# Altium project ETZ.PrjPcb
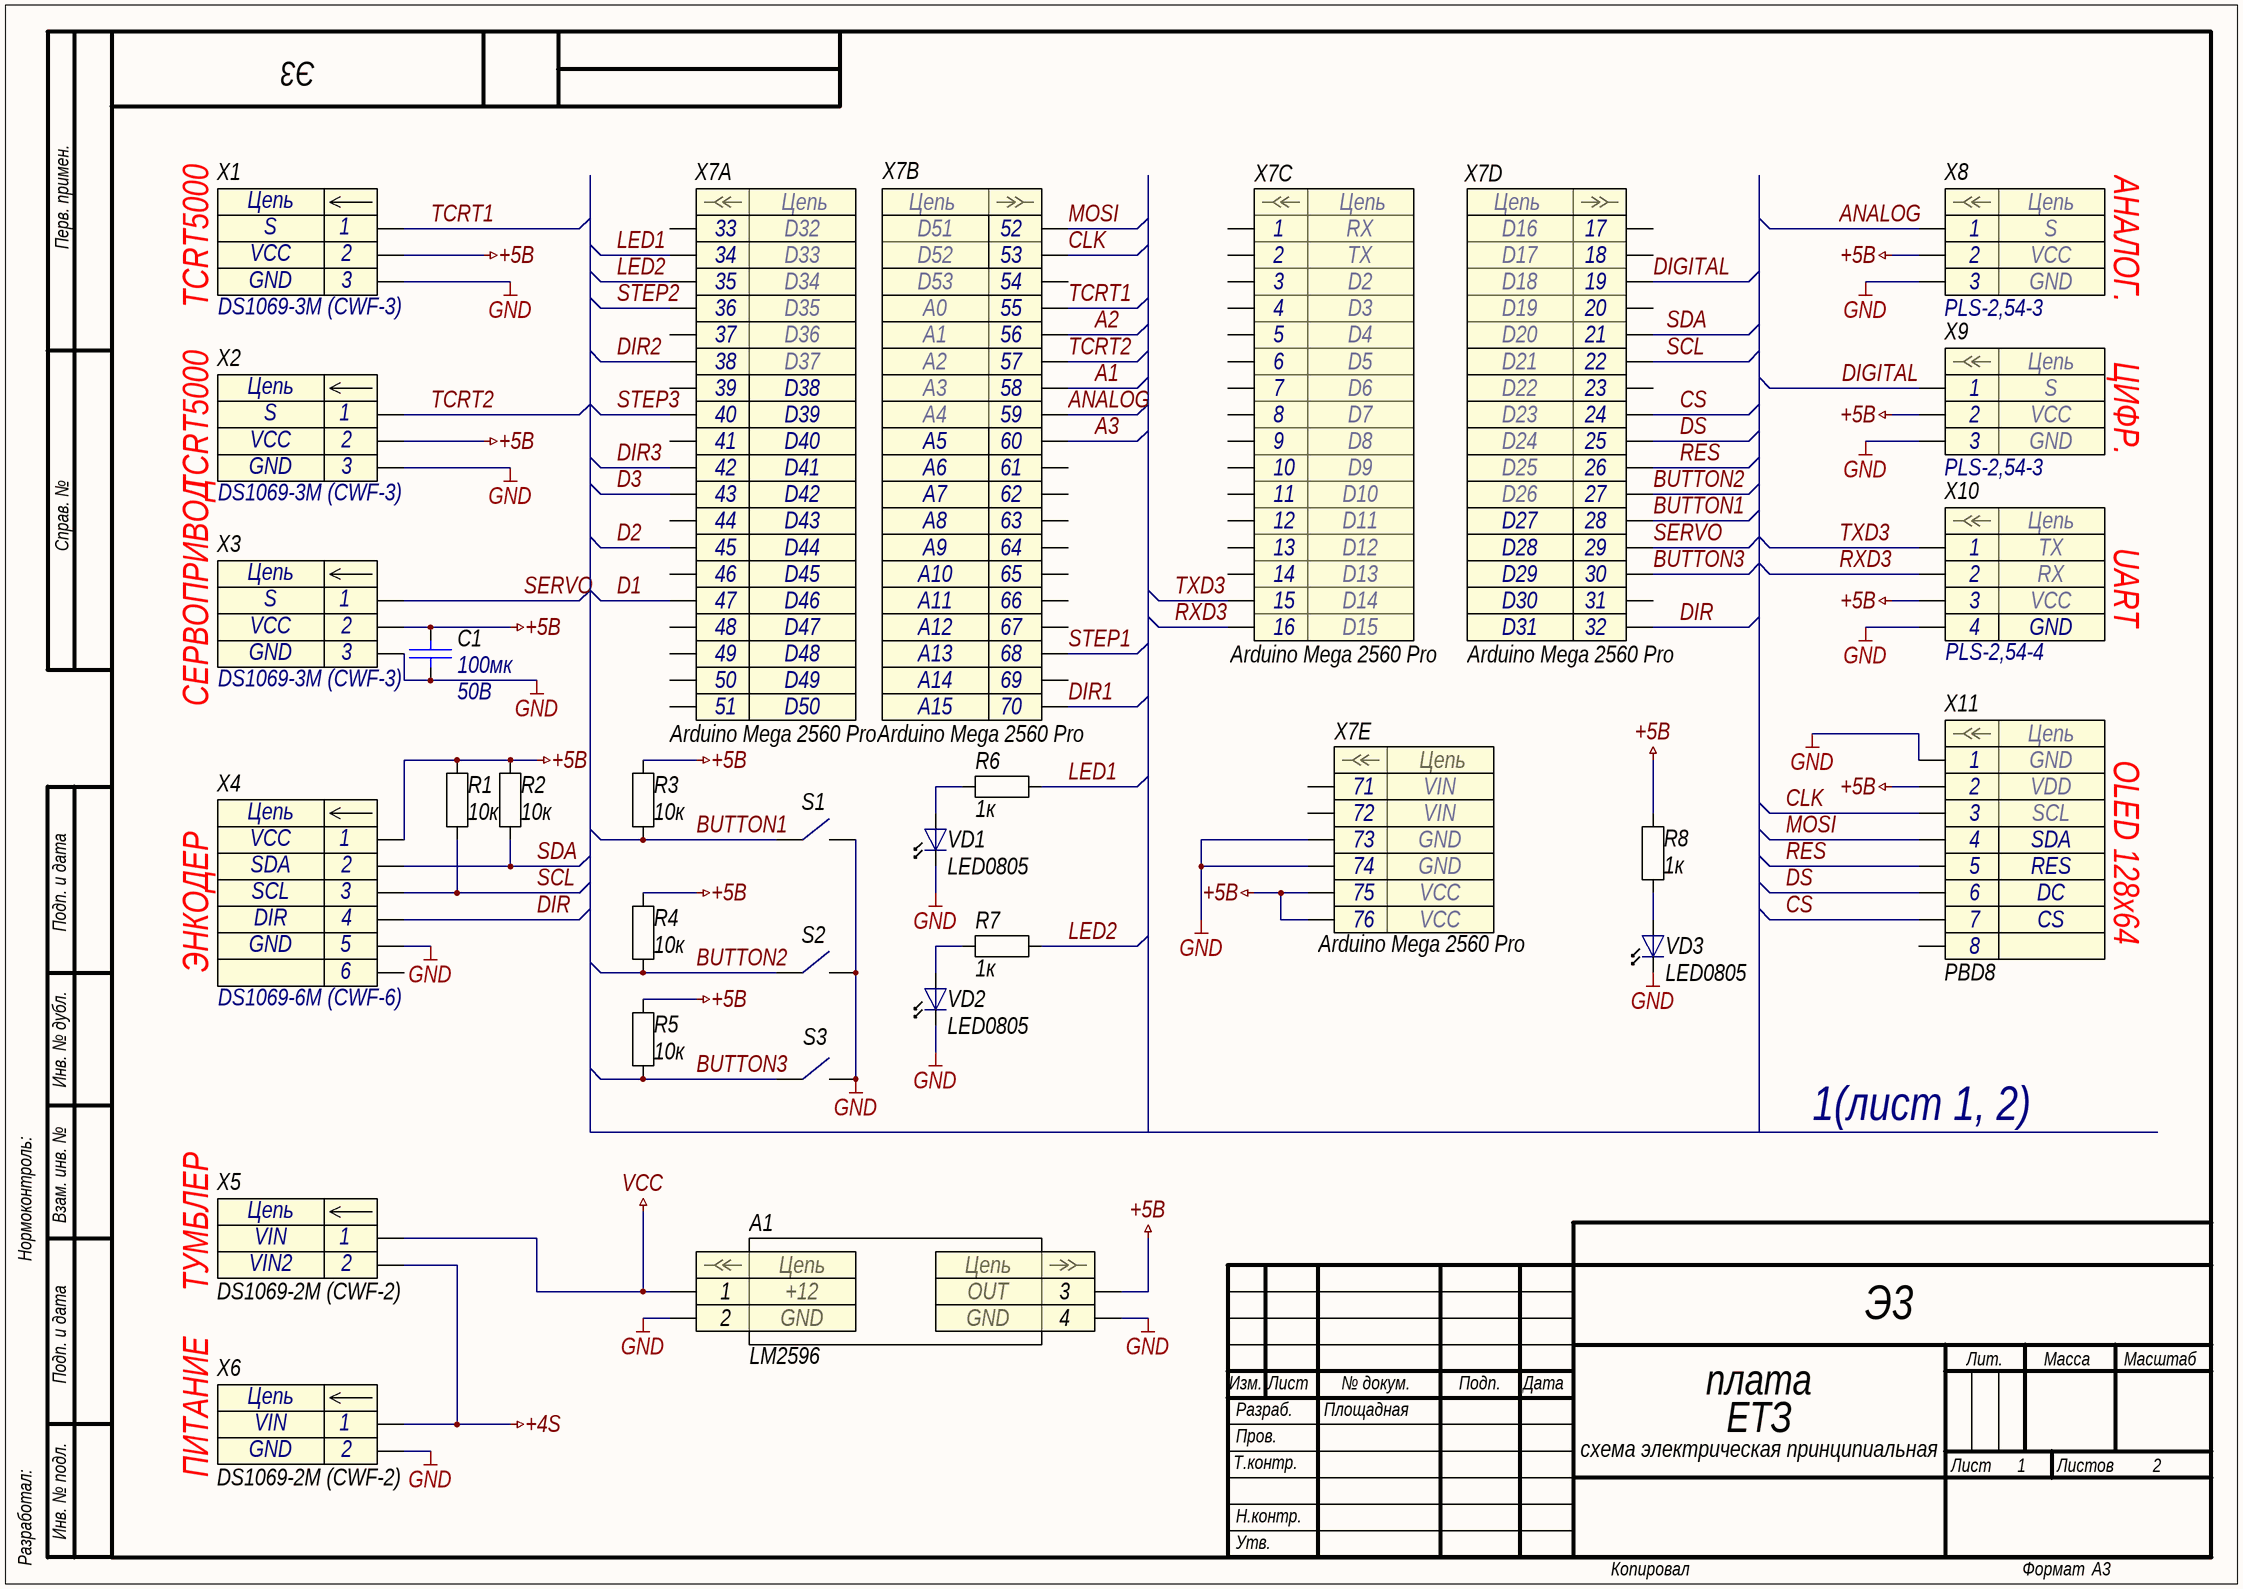
[diagram p0: Э3.SchDoc]
2 sheets, 37 parts. Net scope: global (net labels, ports and power ports of the same name join across sheets).
Board file: ETZZ.PcbDoc
Sheets:
  Э3.SchDoc
  Э3_2.SchDoc

## Sheet Э3.SchDoc: =title_line_1 + title_line_2
size 420 x 297 mm; DrawnBy: Площадная; DocumentNumber: Э3; SheetNumber: 1; SheetTotal: 2; title_line_1: плата; title_line_2: ЕТЗ; document_type: схема электрическая принципиальная

### Parts
A1  LM2596  [LM2596]
C1  Voltage: 50В  [C1210]  (hidden comment: 100мк)
R1  10к  [Resistor0805]
R2  10к  [Resistor0805]
R3  10к  [Resistor0805]
R4  10к  [Resistor0805]
R5  10к  [Resistor0805]
R6  1к  [Resistor0805]
R7  1к  [Resistor0805]
R8  1к  [Resistor0805]
S1  BUTTON12  [THT12]  (value not drawn)
S2  BUTTON12  [THT12]  (value not drawn)
S3  BUTTON12  [THT12]  (value not drawn)
VD1  LED0805  [LED0805]
VD2  LED0805  [LED0805]
VD3  LED0805  [LED0805]
X1  DS1069-3M (CWF-3)  [CWF-3]
X2  DS1069-3M (CWF-3)  [CWF-3]
X3  DS1069-3M (CWF-3)  [CWF-3]
X4  DS1069-6M (CWF-6)  [CWF-6]
X5  DS1069-2M (CWF-2)  [CWF-2]
X6  DS1069-2M (CWF-2)  [CWF-2]
X7  Arduino Mega 2560 Pro  [PBD38]  (parts A,B,C,D,E of 5)
X8  PLS-2,54-3  [PLS-2.54-3]
X9  PLS-2,54-3  [PLS-2.54-3]
X10  PLS-2,54-4  [PLS-2.54-4]
X11  PBD8  [PBD8]

### Nets
+4S: X5.2 X6.1
+5В: A1.3 C1.2 R1.1 R2.1 R3.2 R4.2 R5.2 R8.1 X1.2 X2.2 X3.2 X4.1 X7.75 X7.76 X8.2 X9.2 X10.3 X11.2
GND: A1.2 A1.4 C1.1 S1.1 S2.1 S3.1 VD1.1 VD2.1 VD3.1 X1.3 X2.3 X3.3 X4.5 X6.2 X7.73 X7.74 X8.3 X9.3 X10.4 X11.1
VCC: A1.1 X5.1
A1: X7.58
A2: X7.56
A3: X7.60
ANALOG: X7.59 X8.1
BUTTON1: R3.1 S1.2 X7.28
BUTTON2: R4.1 S2.2 X7.27
BUTTON3: R5.1 S3.2 X7.30
CLK: X7.53 X11.3
CS: X7.24 X11.7
D1: X7.47
D2: X7.45
D3: X7.43
DIGITAL: X7.19 X9.1
DIR: X4.4 X7.32
DIR1: X7.70
DIR2: X7.38
DIR3: X7.42
DS: X7.25 X11.6
LED1: R6.1 X7.34
LED2: R7.1 X7.35
MOSI: X7.52 X11.4
RES: X7.26 X11.5
RXD3: X7.16 X10.2
SCL: R1.2 X4.3 X7.22
SDA: R2.2 X4.2 X7.21
SERVO: X3.1 X7.29
STEP1: X7.68
STEP2: X7.36
STEP3: X7.40
TCRT1: X1.1 X7.55
TCRT2: X2.1 X7.57
TXD3: X7.15 X10.1
NetR6_2: R6.2 VD1.2
NetR7_2: R7.2 VD2.2
NetR8_2: R8.2 VD3.2

Not connected (* = marked no-connect by the designer): X4 6; X7 1 2 3 4 5 6 7 8 9 10 11 12 13 14 17 18 20 23 31 33 37 39 41 44 46 48 49 50 51 54 61 62 63 64 65 66 67 69 71 72; X11 8

### Notes on the sheet
- АНАЛОГ.
- TCRT5000
- ЦИФР.
- UART
- СЕРВОПРИВОД
- OLED 128x64
- ЭНКОДЕР
- 1(лист 1, 2)
- ТУМБЛЕР
- ПИТАНИЕ
- Перв. примен.
- Справ. №
- Подп. и дата
- Инв. № дубл.
- Нормоконтроль:
- Взам. инв. №
- Изм.
- Лист
- № докум.
- Подп.
- Дата
- Лит.
- Масса
- Масштаб
- Т.контр.
- Пров.
- Разраб.
- Листов
- Разработал:
- Инв. № подл.
- Н.контр.
- Утв.
- Копировал
- Формат
- А3
- (in symbol Arduino Mega 2560 Pro, part A) Цепь; D32; D33; D34; D35; D36; D37; D38; D39; D40; D41; D42; D43; D44; D45; D46; D47; D48; D49; D50
- (in symbol Arduino Mega 2560 Pro, part B) Цепь; D51; D52; D53; A0; A1; A2; A3; A4; A5; A6; A7; A8; A9; A10; A11; A12; A13; A14; A15
- (in symbol Arduino Mega 2560 Pro, part C) Цепь; RX; TX; D2; D3; D4; D5; D6; D7; D8; D9; D10; D11; D12; D13; D14; D15
- (in symbol Arduino Mega 2560 Pro, part D) Цепь; D16; D17; D18; D19; D20; D21; D22; D23; D24; D25; D26; D27; D28; D29; D30; D31
- (in symbol Arduino Mega 2560 Pro, part E) Цепь; VIN; GND; VCC
- (in symbol CWF-2) Цепь
- (in symbol CWF-3) Цепь
- (in symbol CWF-6) Цепь
- (in symbol LM2596) Цепь
- (in symbol PBD8) Цепь
- (in symbol PLS-2.54-3 1>2) Цепь
- (in symbol PLS-2.54-4) Цепь

### Library data of the parts
A1 = LM2596: Contact_1: +12; Contact_2: GND; Contact_3: OUT
C1 = CC0603JRNPO9BN220: Конденсатор кер. 100мк 50В; Manufacturer: Yageo; TKE: NP0; Name: CC0603JRNPO9BN220; Value: 100мк
R1-R5 = RESISTOR: nam: 10к
R6-R8 = RESISTOR: nam: резистор
X1-X3 = CWF-3: Разъем - 3 конт. прямая вилка на плату; Contact_1: S; Contact_2: VCC; Contact_3: GND; Name: DS1069-3M (CWF-3)
X4 = CWF-6: Разъем - 6 конт. прямая вилка на плату; Contact_1: VCC; Contact_2: SDA; Contact_3: SCL; Contact_4: DIR; Contact_5: GND; Name: DS1069-6M (CWF-6)
X5 = CWF-2: Разъем - 2 конт. прямая вилка на плату; Contact_1: VIN; Contact_2: VIN2; Name: DS1069-2M (CWF-2)
X6 = CWF-2: Разъем - 2 конт. прямая вилка на плату; Contact_1: VIN; Contact_2: GND; Name: DS1069-2M (CWF-2)
X8 X9 = PLS-2.54-3 1>2: Contact_1: S; Contact_2: VCC; Contact_3: GND; nam: PLS-2,54-3
X10 = PLS-2.54-4: Contact_1: TX; Contact_2: RX; Contact_3: VCC; Contact_4: GND; nam: PLS-2,54-4
X11 = PBD8: Contact_1: GND; Contact_2: VDD; Contact_3: SCL; Contact_4: SDA; Contact_5: RES; Contact_6: DC; Contact_7: CS; nam: PBD8; Parameter 1: *
X7 = Arduino Mega 2560 Pro: nam: Arduino Mega 2560 Pro

## Sheet Э3_2.SchDoc: =title_line_1 + title_line_2
size 420 x 297 mm; DrawnBy: Площадная; DocumentNumber: Э3; SheetNumber: 2; SheetTotal: 2; DocumentCode: Э3; title_line_1: плата; title_line_2: ЕТЗ; document_type: схема электрическая принципиальная
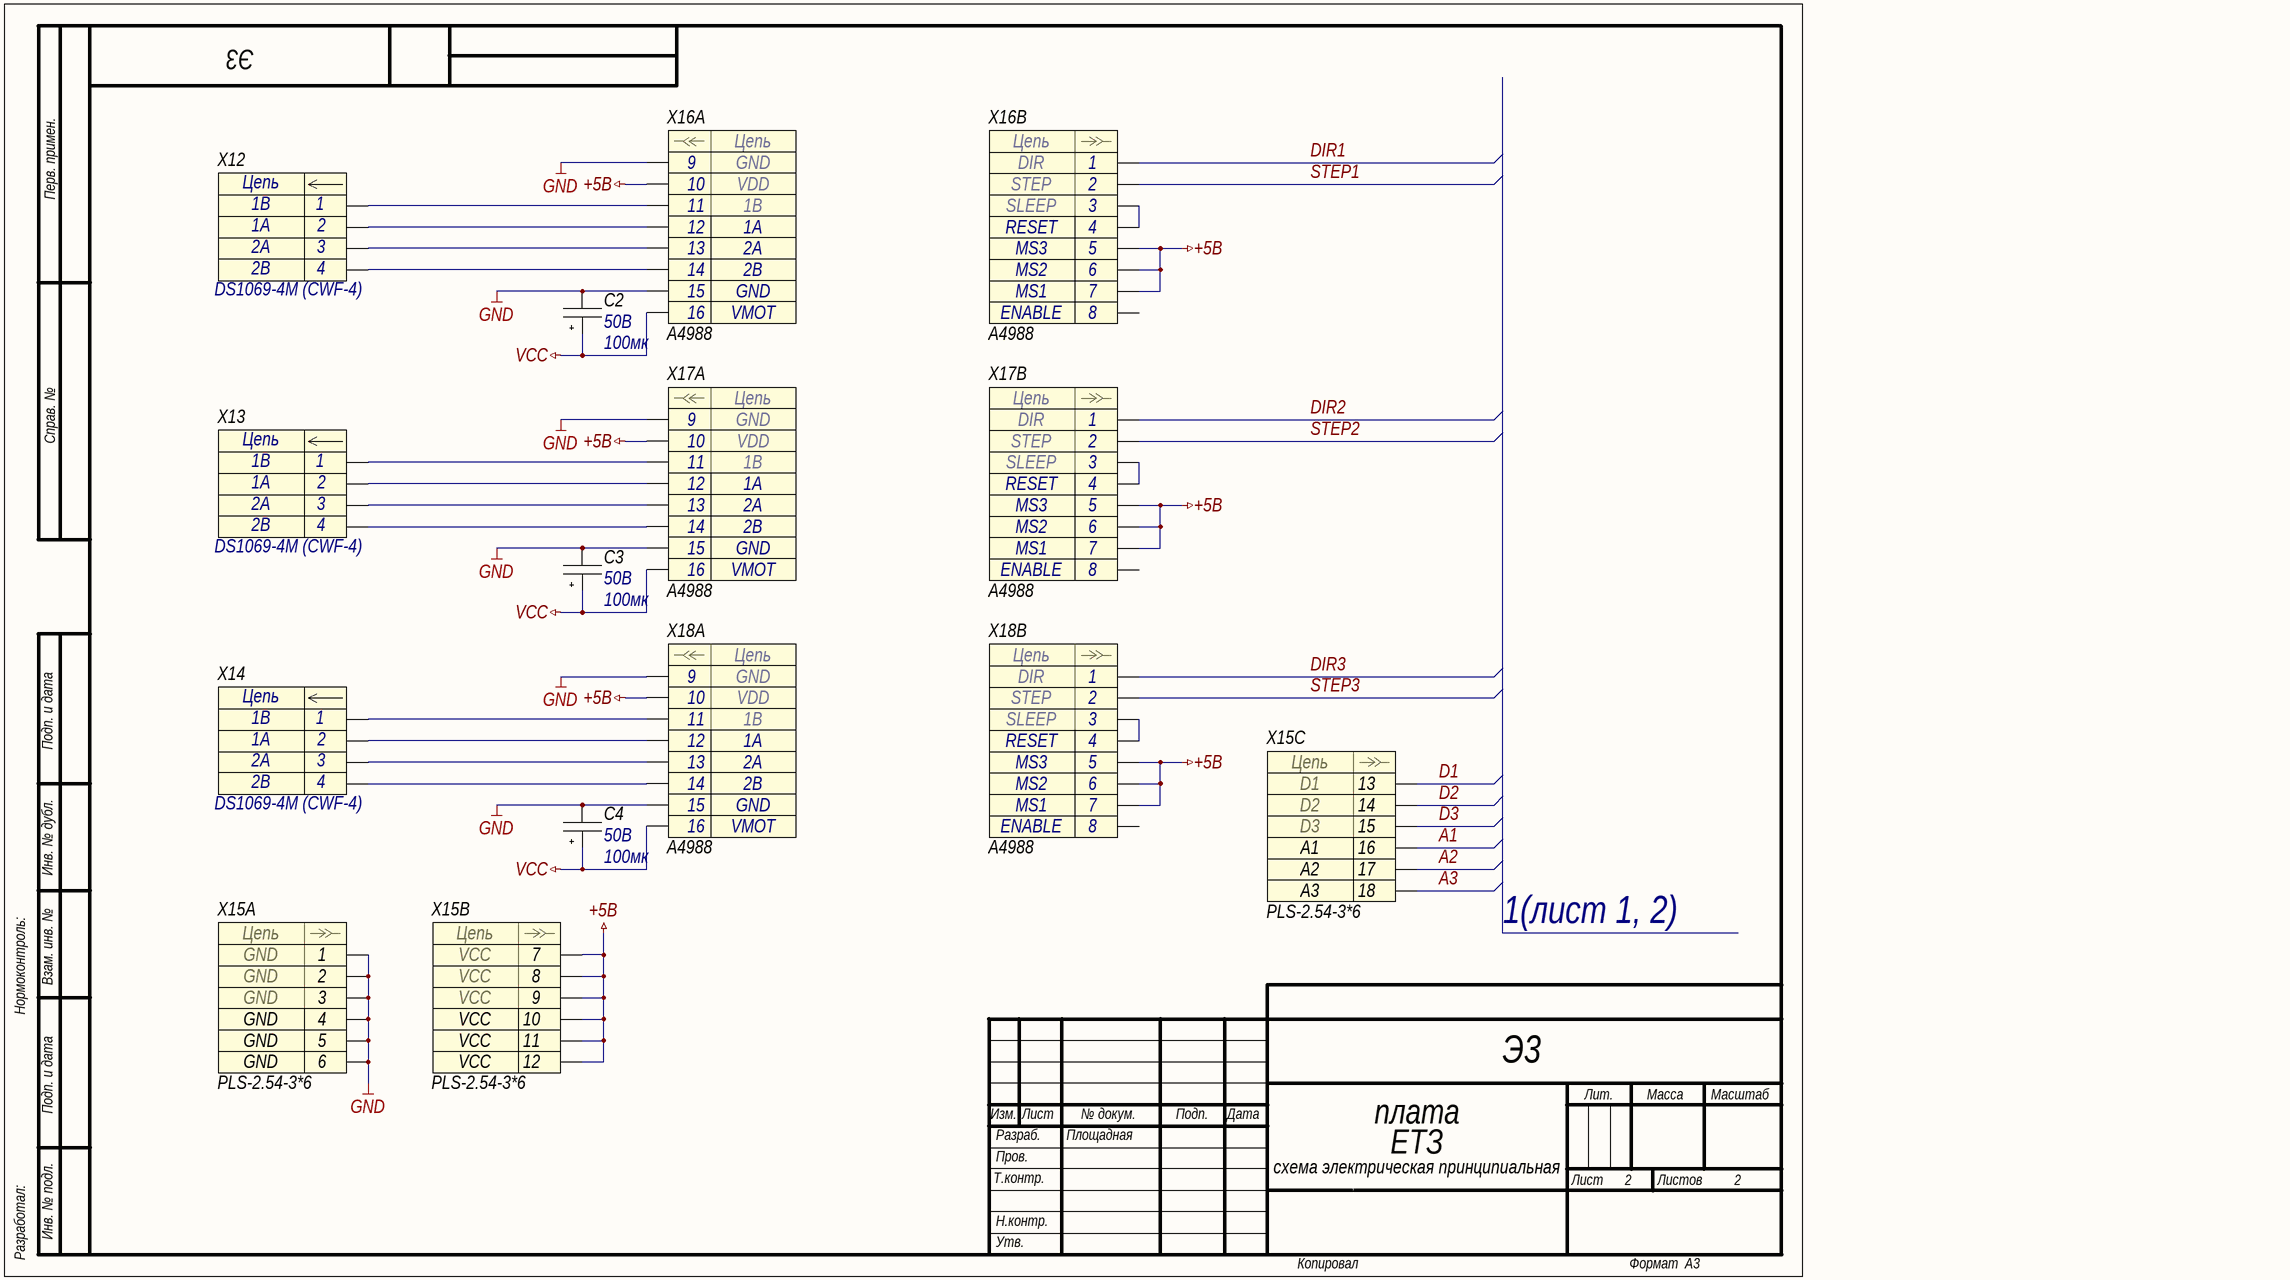
[diagram p1: Э3_2.SchDoc]

### Parts
C2  voltage: 50В  nominal: 100мк  [SK050M0100B3F-0811-up]  (hidden comment: конденсатор)
C3  voltage: 50В  nominal: 100мк  [SK050M0100B3F-0811-up]  (hidden comment: конденсатор)
C4  voltage: 50В  nominal: 100мк  [SK050M0100B3F-0811-up]  (hidden comment: конденсатор)
X12  DS1069-4M (CWF-4)  [CWF-4]
X13  DS1069-4M (CWF-4)  [CWF-4]
X14  DS1069-4M (CWF-4)  [CWF-4]
X15  PLS-2.54-3*6  [PLS-2.54-3*6]  (parts A,B,C of 3)
X16  A4988  [A4988]  (parts A,B of 2)
X17  A4988  [A4988]  (parts A,B of 2)
X18  A4988  [A4988]  (parts A,B of 2)

### Nets
+5В: X15.7 X15.8 X15.9 X15.10 X15.11 X15.12 X16.5 X16.6 X16.7 X16.10 X17.5 X17.6 X17.7 X17.10 X18.5 X18.6 X18.7 X18.10
GND: C2.2 C3.2 C4.2 X15.1 X15.2 X15.3 X15.4 X15.5 X15.6 X16.9 X16.15 X17.9 X17.15 X18.9 X18.15
VCC: C2.1 C3.1 C4.1 X16.16 X17.16 X18.16
A1: X15.16
A2: X15.17
A3: X15.18
D1: X15.13
D2: X15.14
D3: X15.15
DIR1: X16.1
DIR2: X17.1
DIR3: X18.1
STEP1: X16.2
STEP2: X17.2
STEP3: X18.2
NetX12_1: X12.1 X16.11
NetX12_2: X12.2 X16.12
NetX12_3: X12.3 X16.13
NetX12_4: X12.4 X16.14
NetX13_1: X13.1 X17.11
NetX13_2: X13.2 X17.12
NetX13_3: X13.3 X17.13
NetX13_4: X13.4 X17.14
NetX14_1: X14.1 X18.11
NetX14_2: X14.2 X18.12
NetX14_3: X14.3 X18.13
NetX14_4: X14.4 X18.14
NetX16_3: X16.3 X16.4
NetX17_3: X17.3 X17.4
NetX18_3: X18.3 X18.4

Not connected (* = marked no-connect by the designer): X16 8; X17 8; X18 8

### Notes on the sheet
- 1(лист 1, 2)
- Перв. примен.
- Справ. №
- Подп. и дата
- Инв. № дубл.
- Нормоконтроль:
- Взам. инв. №
- Изм.
- Лист
- № докум.
- Подп.
- Дата
- Лит.
- Масса
- Масштаб
- Т.контр.
- Пров.
- Разраб.
- Листов
- Разработал:
- Инв. № подл.
- Н.контр.
- Утв.
- Копировал
- Формат
- А3
- (in symbol A4988, part A) Цепь; GND; VDD; 1B; 1A; 2A; 2B; VMOT
- (in symbol A4988, part B) Цепь; DIR; STEP; SLEEP; RESET; MS3; MS2; MS1; ENABLE
- (in symbol CWF-4) Цепь
- (in symbol PLS-2.54-3*6, part A) Цепь
- (in symbol PLS-2.54-3*6, part B) Цепь
- (in symbol PLS-2.54-3*6, part C) Цепь

### Library data of the parts
C2-C4 = SK050M0100B3F-0811: nam: конденсатор
X12-X14 = CWF-4: Разъем - 4 конт. прямая вилка на плату; Contact_1: 1B; Contact_2: 1A; Contact_3: 2A; Contact_4: 2B; Name: DS1069-4M (CWF-4)
X15 = PLS-2.54-3*6: Contact_1: GND; Contact_7: VCC; Contact_2: GND; Contact_3: GND; Contact_4: GND; Contact_5: GND; Contact_6: GND; Contact_8: VCC; Contact_9: VCC; Contact_10: VCC; Contact_11: VCC; Contact_12: VCC; Contact_13: *; Contact_14: *; Contact_15: *; Contact_16: *; Contact_17: *; Contact_18: *

## Nets that join several sheets
+5В: Э3 (18 pins), Э3_2 (18 pins)
GND: Э3 (20 pins), Э3_2 (15 pins)
VCC: Э3 (A1.1 X5.1), Э3_2 (6 pins)
A1: Э3 (X7.58), Э3_2 (X15.16)
A2: Э3 (X7.56), Э3_2 (X15.17)
A3: Э3 (X7.60), Э3_2 (X15.18)
D1: Э3 (X7.47), Э3_2 (X15.13)
D2: Э3 (X7.45), Э3_2 (X15.14)
D3: Э3 (X7.43), Э3_2 (X15.15)
DIR1: Э3 (X7.70), Э3_2 (X16.1)
DIR2: Э3 (X7.38), Э3_2 (X17.1)
DIR3: Э3 (X7.42), Э3_2 (X18.1)
STEP1: Э3 (X7.68), Э3_2 (X16.2)
STEP2: Э3 (X7.36), Э3_2 (X17.2)
STEP3: Э3 (X7.40), Э3_2 (X18.2)